# Altium schematic sheet Converter_PWM to Voltage.SchDoc
size 127 x 63 mm
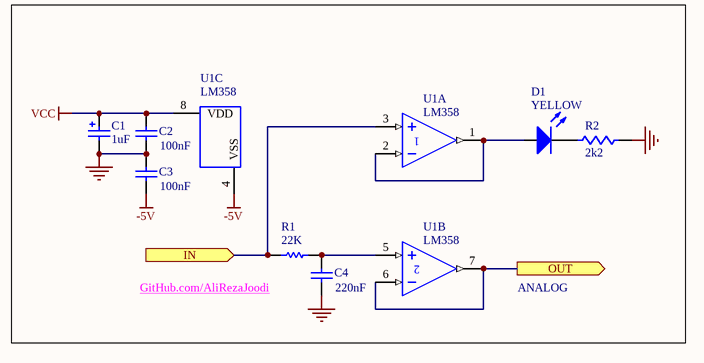
[diagram p0: Converter_PWM to Voltage.SchDoc]

## Parts
C1  value 1uF  [Cap_A]  (hidden comment: Cap Pol1)
C2  value 100nF  [0805]  (hidden comment: Cap)
C3  value 100nF  [0805]  (hidden comment: Cap)
C4  value 220nF  [0805]  (hidden comment: Cap)
D1  YELLOW  [0805_Diode]
R1  value 22K  [0805]  (hidden comment: Res1)
R2  value 2k2  [0805]  (hidden comment: RES)
U1  LM358  [SOP127P636-8N]  (parts A,B,C of 3)

## Ports
IN (in), OUT (out)

## Nets
-5V: C3.2 U1.4(VSS)
GND: C1.2 C2.2 C3.1 C4.1 R2.2
VCC: C1.1 C2.1 U1.8(VDD)
IN: R1.1 U1.3(IN+) ; port IN
OUT: U1.6(IN-) U1.7(OUT) ; port OUT
NetC4_2: C4.2 R1.2 U1.5(IN+)
NetD1_1: D1.1(A) U1.1(OUT) U1.2(IN-)
NetD1_2: D1.2(K) R2.1

## Notes on the sheet
- GitHub.com/AliRezaJoodi
- ANALOG

## Library data of the parts
C1 = Cap Pol1: Polarized Capacitor (Radial); Manufacturer: Generic Components; Class I: Passive; Published: 8-Jun-2000; Revision: July-2002: Re-released for DXP Platform.; Publisher: Altium Limited; Class II: Capacitor
C2-C4 = Cap: Capacitor; Published: 8-Jun-2000; LatestRevisionDate: 17-Jul-2002; LatestRevisionNote: Re-released for DXP Platform.; PackageReference: RAD-0.3; Publisher: Altium Limited
D1 = LED: Typical INFRARED GaAs LED; Manufacturer: Generic Components; Class I: Optoelectronic; Published: 8-Jun-2000; Revision: July-2002: Re-released for DXP Platform.; Publisher: Altium Limited; Class II: LED
R1 = Res1: Resistor; Published: 8-Jun-2000; LatestRevisionDate: 17-Jul-2002; LatestRevisionNote: Re-released for DXP Platform.; PackageReference: AXIAL-0.3; Publisher: Altium Limited
R2 = Res1: Resistor; Manufacturer: Generic Components; Class I: Passive; Published: 8-Jun-2000; Revision: July-2002: Re-released for DXP Platform.; Publisher: Altium Limited; Class II: Resistor
U1 = LM358: Dual Low-Power Operational Amplifier; Published: 17-Jul-2002; LatestRevisionDate: 13-Apr-2006; LatestRevisionNote: IPC-7351 Footprint Added.; DatasheetVersion: 1988; PackageReference: 751-02; Publisher: Altium Limited; PackageDescription: 8-Pin Small Outline Integrated Circuit 1.27 mm Pitch; Code_JEDEC: MS-012-AA; Code_IPC: SOIC127P600-8; ComponentLink1Description: Manufacturer Link; ComponentLink1URL: http://www.onsemi.com/site/products/parametrics/0,4446,251,00.html; ComponentLink2Description: Datasheet; ComponentLink2URL: http://www.onsemi.com/pub/Collateral/LM358-D.PDF